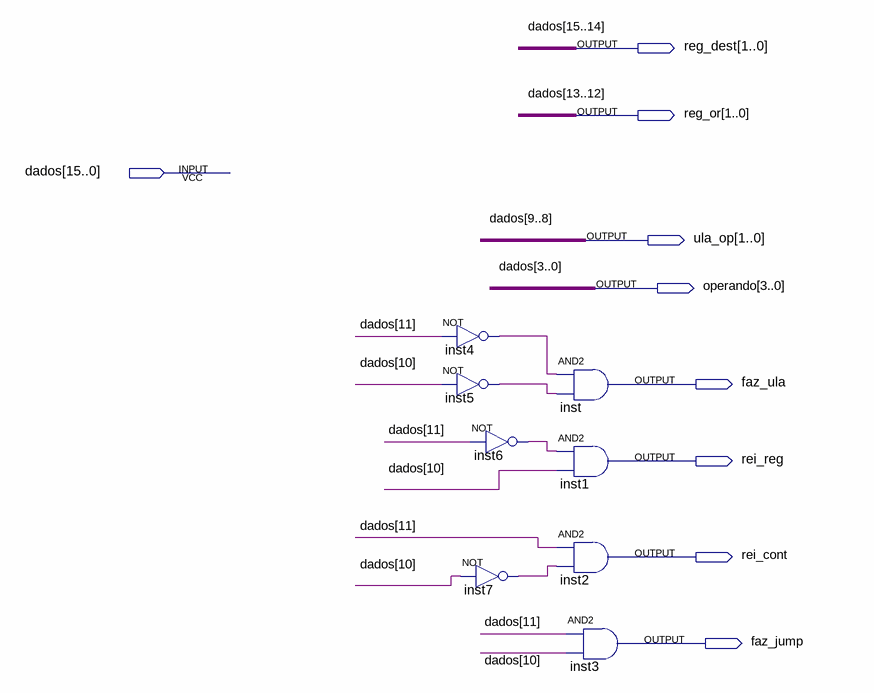
[diagram p0: schematic sheet]
// Quartus schematic unidade_de_controle.bdf as structural Verilog: 8 symbols, 9 pins
module unidade_de_controle (
  input  [15:0] dados,
  output [1:0] reg_dest,
  output [1:0] reg_or,
  output [1:0] ula_op,
  output [3:0] operando,
  output faz_ula,
  output rei_reg,
  output rei_cont,
  output faz_jump
);

  wire inst4_out, inst5_out, inst6_out, inst7_out;

  not inst4 (inst4_out, dados[11]);
  not inst5 (inst5_out, dados[10]);
  not inst6 (inst6_out, dados[11]);
  not inst7 (inst7_out, dados[10]);
  and inst (faz_ula, inst4_out, inst5_out);
  and inst1 (rei_reg, inst6_out, dados[10]);
  and inst2 (rei_cont, dados[11], inst7_out);
  and inst3 (faz_jump, dados[11], dados[10]);

  assign operando = dados[3:0];
  assign reg_dest = dados[15:14];
  assign reg_or = dados[13:12];
  assign ula_op = dados[9:8];
endmodule
